# Altium schematic sheet Temp Sense.SchDoc
size A
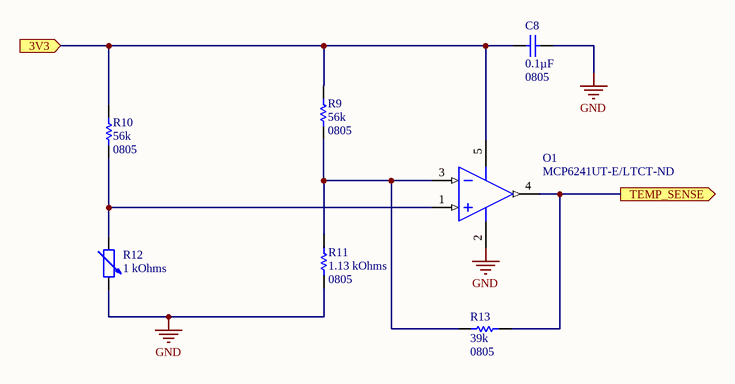
[diagram p0: Temp Sense.SchDoc]

## Parts
C8  Capacitance: 0.1µF  Package / Case: 0805  [CAP0805]  (hidden comment: C0805C104K5RACTU)
O1  Supplier Part Number 1: MCP6241UT-E/LTCT-ND  [MCP6241U]  (hidden comment: MCP6241U)
R9  Resistance: 56k  Package / Case: 0805  [RES0805]  (hidden comment: RC0805FR-0756KL)
R10  Resistance: 56k  Package / Case: 0805  [RES0805]  (hidden comment: RC0805FR-0756KL)
R11  Resistance: 1.13 kOhms  Supplier Device Package: 0805  [RES0805]  (hidden comment: ERJ-6ENF1131V)
R12  Resistance: 1 kOhms  [G-NICO-001]  (hidden comment: G-NICO-001)
R13  Resistance: 39k  Package / Case: 0805  [RES0805]  (hidden comment: RC0805FR-0739KL)

## Ports
3V3 (in), TEMP_SENSE (out)

## Nets
GND: C8.1 O1.2(V-) R11.1 R12.2
3V3: C8.2 O1.5(V+) R9.2 R10.2 ; port 3V3
TEMP_SENSE: O1.4(OUT) R13.2 ; port TEMP_SENSE
NetO1_1: O1.1(IN+) R10.1 R12.1
NetO1_3: O1.3(IN-) R9.1 R11.2 R13.1

## Library data of the parts
C8 = C0805C104K5RACTU: CAP CER 0.1UF 50V X7R 0805; Tolerance: ±10%; Supplier 1: Digi-Key; Supplier Part Number 1: 399-1170-1-ND; Voltage - Rated: 50V; Temperature Coefficient: X7R
O1 = MCP6241U: IC OPAMP GP 550KHZ RRO SC70-5; Amplifier Type: General Purpose; Number of Circuits: 1; Output Type: Rail-to-Rail; Slew Rate: 0.3 V/µs; Current - Input Bias: 1pA; Voltage - Input Offset: 5mV; Current - Supply: 50µA; Current - Output / Channel: 23mA; Voltage - Supply, Single/Dual (±): 1.8 V ~ 5.5 V; Gain Bandwidth Product: 550kHz; -3db Bandwidth: -; Operating Temperature: -40°C ~ 125°C; Package / Case: 5-TSSOP, SC-70-5, SOT-353; Supplier 1: Digi-Key
R9 R10 = RC0805FR-0756KL: RES SMD 56K OHM 1% 1/8W 0805; Power (Watts): 0.125W, 1/8W; Temperature Coefficient: ±100ppm/°C; Tolerance: ±1%; Composition: Thick Film; Features: Moisture Resistant; Operating Temperature: -55°C ~ 155°C; Supplier 1: Digi-Key; Supplier Part Number 1: 311-56.0KCRCT-ND
R11 = ERJ-6ENF1131V: RES SMD 1.13K OHM 1% 1/8W 0805; Detailed Description: ±1% 0.125W, 1/8W Chip Resistor 0805 (2012 Metric) Automotive AEC-Q200 Thick Film; Power (Watts): 0.125W, 1/8W; Tolerance: ±1%; Features: Automotive AEC-Q200; Operating Temperature: -55°C ~ 155°C; Height - Seated (Max): 0.028" (0.70mm); Supplier 1: Digi-Key; Supplier Part Number 1: P1.13KCCT-ND
R12 = G-NICO-001: SENSOR TEMP RTD 1.0K OHM SOT23; Manufacturer: TE Connectivity Measurement Specialties; Current: 5mA; Package / Case: TO-236-3, SC-59, SOT-23-3; Thermistor Type: RTD; Temperature: -55°C ~ 150°C; Supplier 1: Digi-Key; Supplier Part Number 1: 223-1563-1-ND
R13 = RC0805FR-0739KL: RES SMD 39K OHM 1% 1/8W 0805; Power (Watts): 0.125W, 1/8W; Temperature Coefficient: ±100ppm/°C; Tolerance: ±1%; Composition: Thick Film; Features: Moisture Resistant; Operating Temperature: -55°C ~ 155°C; Supplier 1: Digi-Key; Supplier Part Number 1: 311-39.0KCRCT-ND